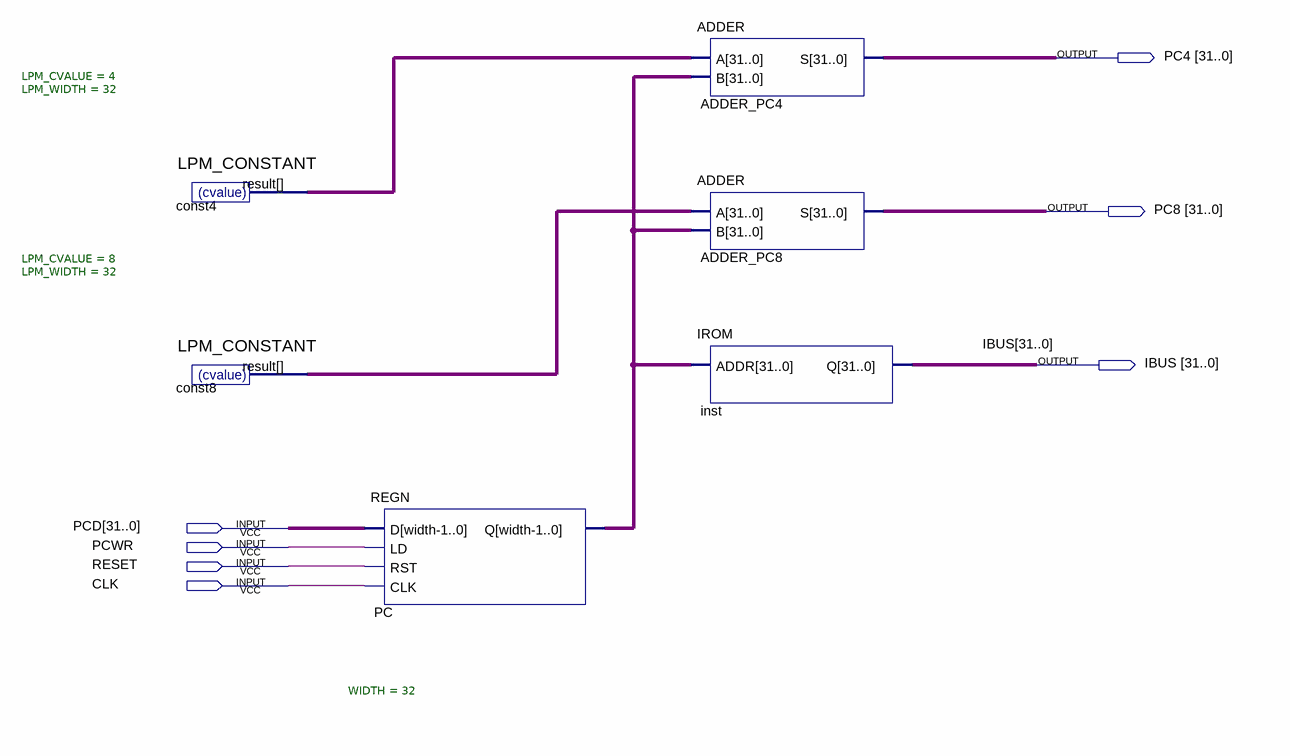
[diagram p0: schematic sheet]
// Quartus schematic Fetch.bdf as structural Verilog: 6 symbols, 7 pins
module Fetch (
  input  [31:0] PCD,
  input  PCWR,
  input  RESET,
  input  CLK,
  output [31:0] PC4,
  output [31:0] PC8,
  output [31:0] IBUS
);

  wire [31:0] const4_result, const8_result, PC_q;

  LPM_CONSTANT #(.LPM_CVALUE(4), .LPM_WIDTH(32)) const4 (.result(const4_result));
  LPM_CONSTANT #(.LPM_CVALUE(8), .LPM_WIDTH(32)) const8 (.result(const8_result));
  REGN #(.WIDTH(32)) PC (.D(PCD), .LD(PCWR), .RST(RESET), .CLK(CLK), .Q(PC_q));
  ADDER ADDER_PC4 (.A(const4_result), .B(PC_q), .S(PC4));
  ADDER ADDER_PC8 (.A(const8_result), .B(PC_q), .S(PC8));
  IROM inst (.ADDR(PC_q), .Q(IBUS));
endmodule
